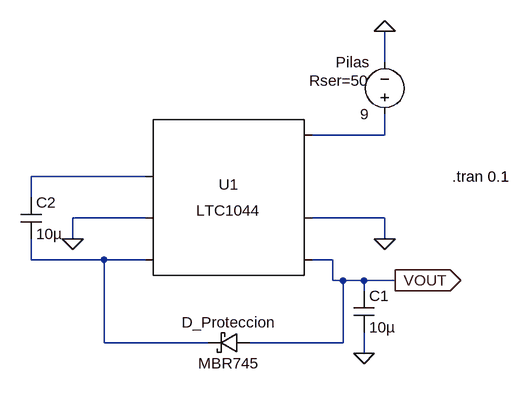
[diagram p0: schematic ICL7660.asc]
ICL7660.asc, the LTspice schematic file:
Version 4
SHEET 1 880 680
WIRE 352 -48 352 -96
WIRE 352 64 352 32
WIRE 352 64 240 64
WIRE -16 128 -192 128
WIRE -192 160 -192 128
WIRE -16 192 -128 192
WIRE 352 192 240 192
WIRE -128 224 -128 192
WIRE 352 224 352 192
WIRE -192 256 -192 224
WIRE -80 256 -192 256
WIRE -16 256 -80 256
WIRE 272 256 240 256
WIRE 272 288 272 256
WIRE 288 288 272 288
WIRE 320 288 288 288
WIRE 368 288 320 288
WIRE 320 304 320 288
WIRE -80 384 -80 256
WIRE 80 384 -80 384
WIRE 288 384 288 288
WIRE 288 384 144 384
WIRE 320 400 320 368
FLAG -128 224 0
FLAG 352 224 0
FLAG 352 -96 0
FLAG 320 400 0
FLAG 368 288 VOUT
IOPIN 368 288 Out
SYMBOL PowerProducts\\LTC1044 112 160 R0
SYMATTR InstName U1
SYMBOL voltage 352 48 R180
WINDOW 0 24 96 Left 2
WINDOW 3 24 16 Left 2
WINDOW 123 0 0 Left 0
WINDOW 39 24 68 Left 2
SYMATTR InstName Pilas
SYMATTR Value 9
SYMATTR SpiceLine Rser=50
SYMBOL cap 304 304 R0
SYMATTR InstName C1
SYMATTR Value 10µ
SYMBOL cap -208 160 R0
SYMATTR InstName C2
SYMATTR Value 10µ
SYMBOL schottky 144 368 R90
WINDOW 0 0 32 VBottom 2
WINDOW 3 32 32 VTop 2
SYMATTR InstName D_Proteccion
SYMATTR Value MBR745
SYMATTR Description Diode
SYMATTR Type diode
TEXT 456 128 Left 2 !.tran 0.1

The netlist it stands for:
* ICL7660.asc
XU1 NC_01 N002 0 N003 VOUT 0 NC_02 N001 LTC1044
V§Pilas N001 0 9 Rser=50
C1 VOUT 0 10µ
C2 N002 N003 10µ
D_Proteccion VOUT N003 MBR745
.model D D
.lib standard.dio
.tran 0.1
.lib LTC1044.sub
.backanno
.end